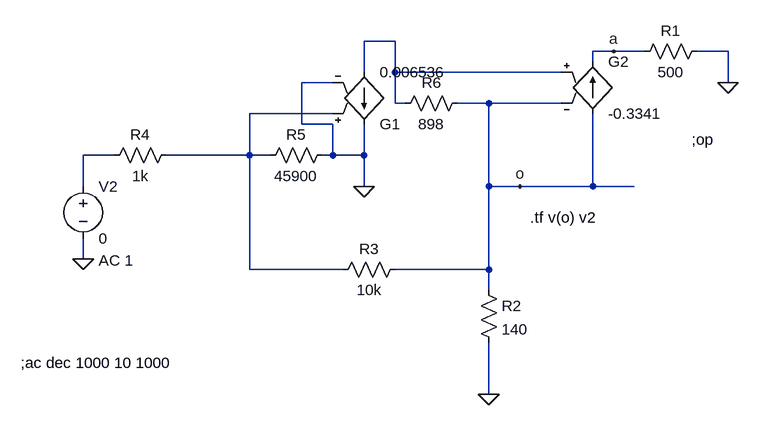
[diagram p0: schematic prueba real3_1.asc]
prueba real3_1.asc, the LTspice schematic file:
Version 4
SHEET 1 880 680
WIRE 304 16 256 16
WIRE 640 32 608 32
WIRE 688 32 640 32
WIRE 816 32 768 32
WIRE 608 48 608 32
WIRE 256 64 256 16
WIRE 304 64 304 16
WIRE 560 64 304 64
WIRE 208 80 160 80
WIRE 816 80 816 32
WIRE 304 112 304 64
WIRE 320 112 304 112
WIRE 448 112 400 112
WIRE 560 112 448 112
WIRE 208 128 80 128
WIRE 160 144 160 80
WIRE 208 144 160 144
WIRE -128 192 -176 192
WIRE 80 192 80 128
WIRE 80 192 -48 192
WIRE 112 192 80 192
WIRE 208 192 208 144
WIRE 208 192 192 192
WIRE 256 192 256 144
WIRE 256 192 208 192
WIRE -176 240 -176 192
WIRE 256 240 256 192
WIRE 448 240 448 112
WIRE 496 240 448 240
WIRE 608 240 608 128
WIRE 608 240 496 240
WIRE 672 240 608 240
WIRE -176 352 -176 320
WIRE 80 368 80 192
WIRE 224 368 80 368
WIRE 448 368 448 240
WIRE 448 368 304 368
WIRE 448 400 448 368
WIRE 448 560 448 480
FLAG 448 560 0
FLAG -176 352 0
FLAG 496 240 o
FLAG 256 240 0
FLAG 816 80 0
FLAG 640 32 a
SYMBOL res 432 384 R0
SYMATTR InstName R2
SYMATTR Value 140
SYMBOL res 320 352 R90
WINDOW 0 0 56 VBottom 2
WINDOW 3 32 56 VTop 2
SYMATTR InstName R3
SYMATTR Value 10k
SYMBOL res -32 176 R90
WINDOW 0 0 56 VBottom 2
WINDOW 3 32 56 VTop 2
SYMATTR InstName R4
SYMATTR Value 1k
SYMBOL voltage -176 224 R0
WINDOW 123 24 130 Left 2
WINDOW 39 0 0 Left 2
SYMATTR Value2 AC 1
SYMATTR InstName V2
SYMATTR Value 0
SYMBOL res 208 176 R90
WINDOW 0 0 56 VBottom 2
WINDOW 3 32 56 VTop 2
SYMATTR InstName R5
SYMATTR Value 45900
SYMBOL g 256 160 M180
SYMATTR InstName G1
SYMATTR Value 0.006536
SYMBOL res 416 96 R90
WINDOW 0 0 56 VBottom 2
WINDOW 3 32 56 VTop 2
SYMATTR InstName R6
SYMATTR Value 898
SYMBOL g 608 32 R0
SYMATTR InstName G2
SYMATTR Value -0.3341
SYMBOL res 784 16 R90
WINDOW 0 0 56 VBottom 2
WINDOW 3 32 56 VTop 2
SYMATTR InstName R1
SYMATTR Value 500
TEXT 760 168 Left 2 !;op
TEXT 512 288 Left 2 !.tf v(o) v2
TEXT -272 512 Left 2 !;ac dec 1000 10 1000

The netlist it stands for:
* prueba real3_1.asc
R2 o 0 140
R3 o N002 10k
R4 N002 N003 1k
V2 N003 0 0 AC 1
R5 0 N002 45900
G1 N001 0 N002 0 0.006536
R6 o N001 898
G2 o a N001 o -0.3341
R1 0 a 500
;op
.tf v(o) v2
;ac dec 1000 10 1000
.backanno
.end